# EasyEDA schematic 1-Schematic_ADXL335_Breakout.json
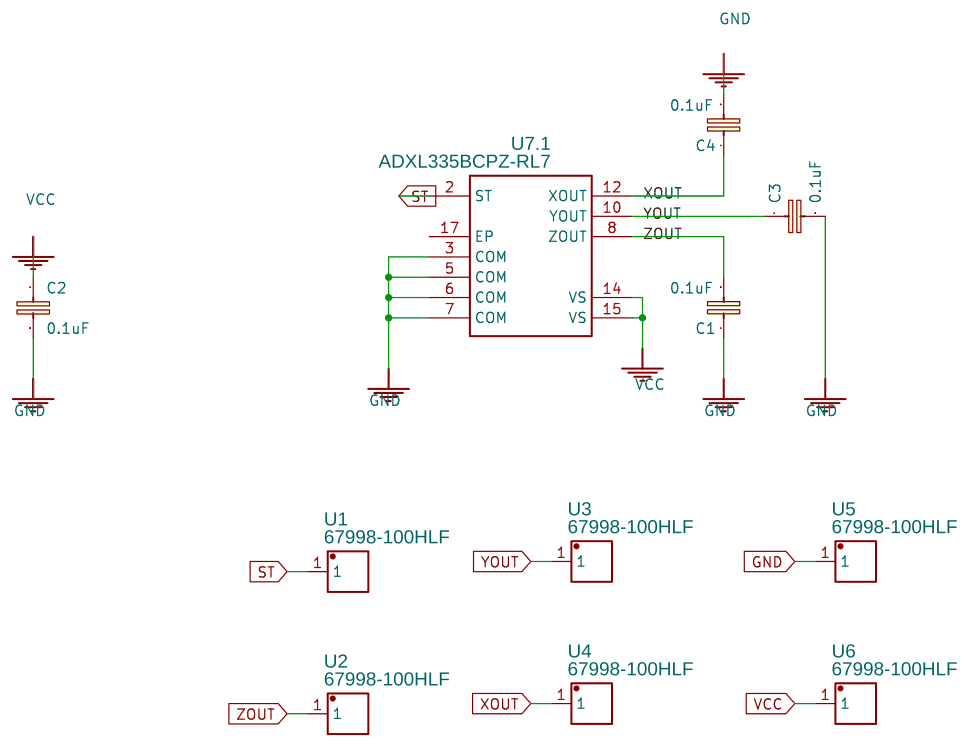
[diagram p0: schematic sheet]

## Parts
C1  0.1uF  [0603-CAP]
C2  0.1uF  [0603-CAP]
C3  0.1uF  [0603-CAP]
C4  0.1uF  [0603-CAP]
U1  67998-100HLF  [HDR-TH_1P-P2.54-V-M]
U2  67998-100HLF  [HDR-TH_1P-P2.54-V-M]
U3  67998-100HLF  [HDR-TH_1P-P2.54-V-M]
U4  67998-100HLF  [HDR-TH_1P-P2.54-V-M]
U5  67998-100HLF  [HDR-TH_1P-P2.54-V-M]
U6  67998-100HLF  [HDR-TH_1P-P2.54-V-M]
U7  ADXL335BCPZ-RL7  [LFCSP-16_L4.0-W4.0-P0.65-TL-EP]  (section 1)

## Library data of the parts
U1-U6 = 67998-100HLF: Contributor: LCSC; Supplier: LCSC; Supplier Part: C213444; Manufacturer: Amphenol
U7 = ADXL335BCPZ-RL7: tags: Accelerometer; subpart_no: 1; image: http://image.lceda.cn/szlcsc/C34439.jpg; Supplier Part: C34439; Supplier: LCSC; Manufacturer: ADI(亚德诺); JLCPCB Part Class: Extended Part; link: https://lcsc.com/eda_search?q=C34439&%26type=1&ref=editor

## Nets
GND: C1.1 C2.2 C3.2 C4.2 U5.1 U7.3(COM) U7.5(COM) U7.6(COM) U7.7(COM)
VCC: C2.1 U6.1 U7.14(VS) U7.15(VS)
ST: U1.1 U7.2(ST)
XOUT: C4.1 U4.1 U7.12(XOUT)
YOUT: C3.1 U3.1 U7.10(YOUT)
ZOUT: C1.2 U2.1 U7.8(ZOUT)

Not connected (* = marked no-connect by the designer): U7 17(EP)
